# EAGLE schematic untitled (EAGLE 9.4.2)

## Sheet 1 of 6
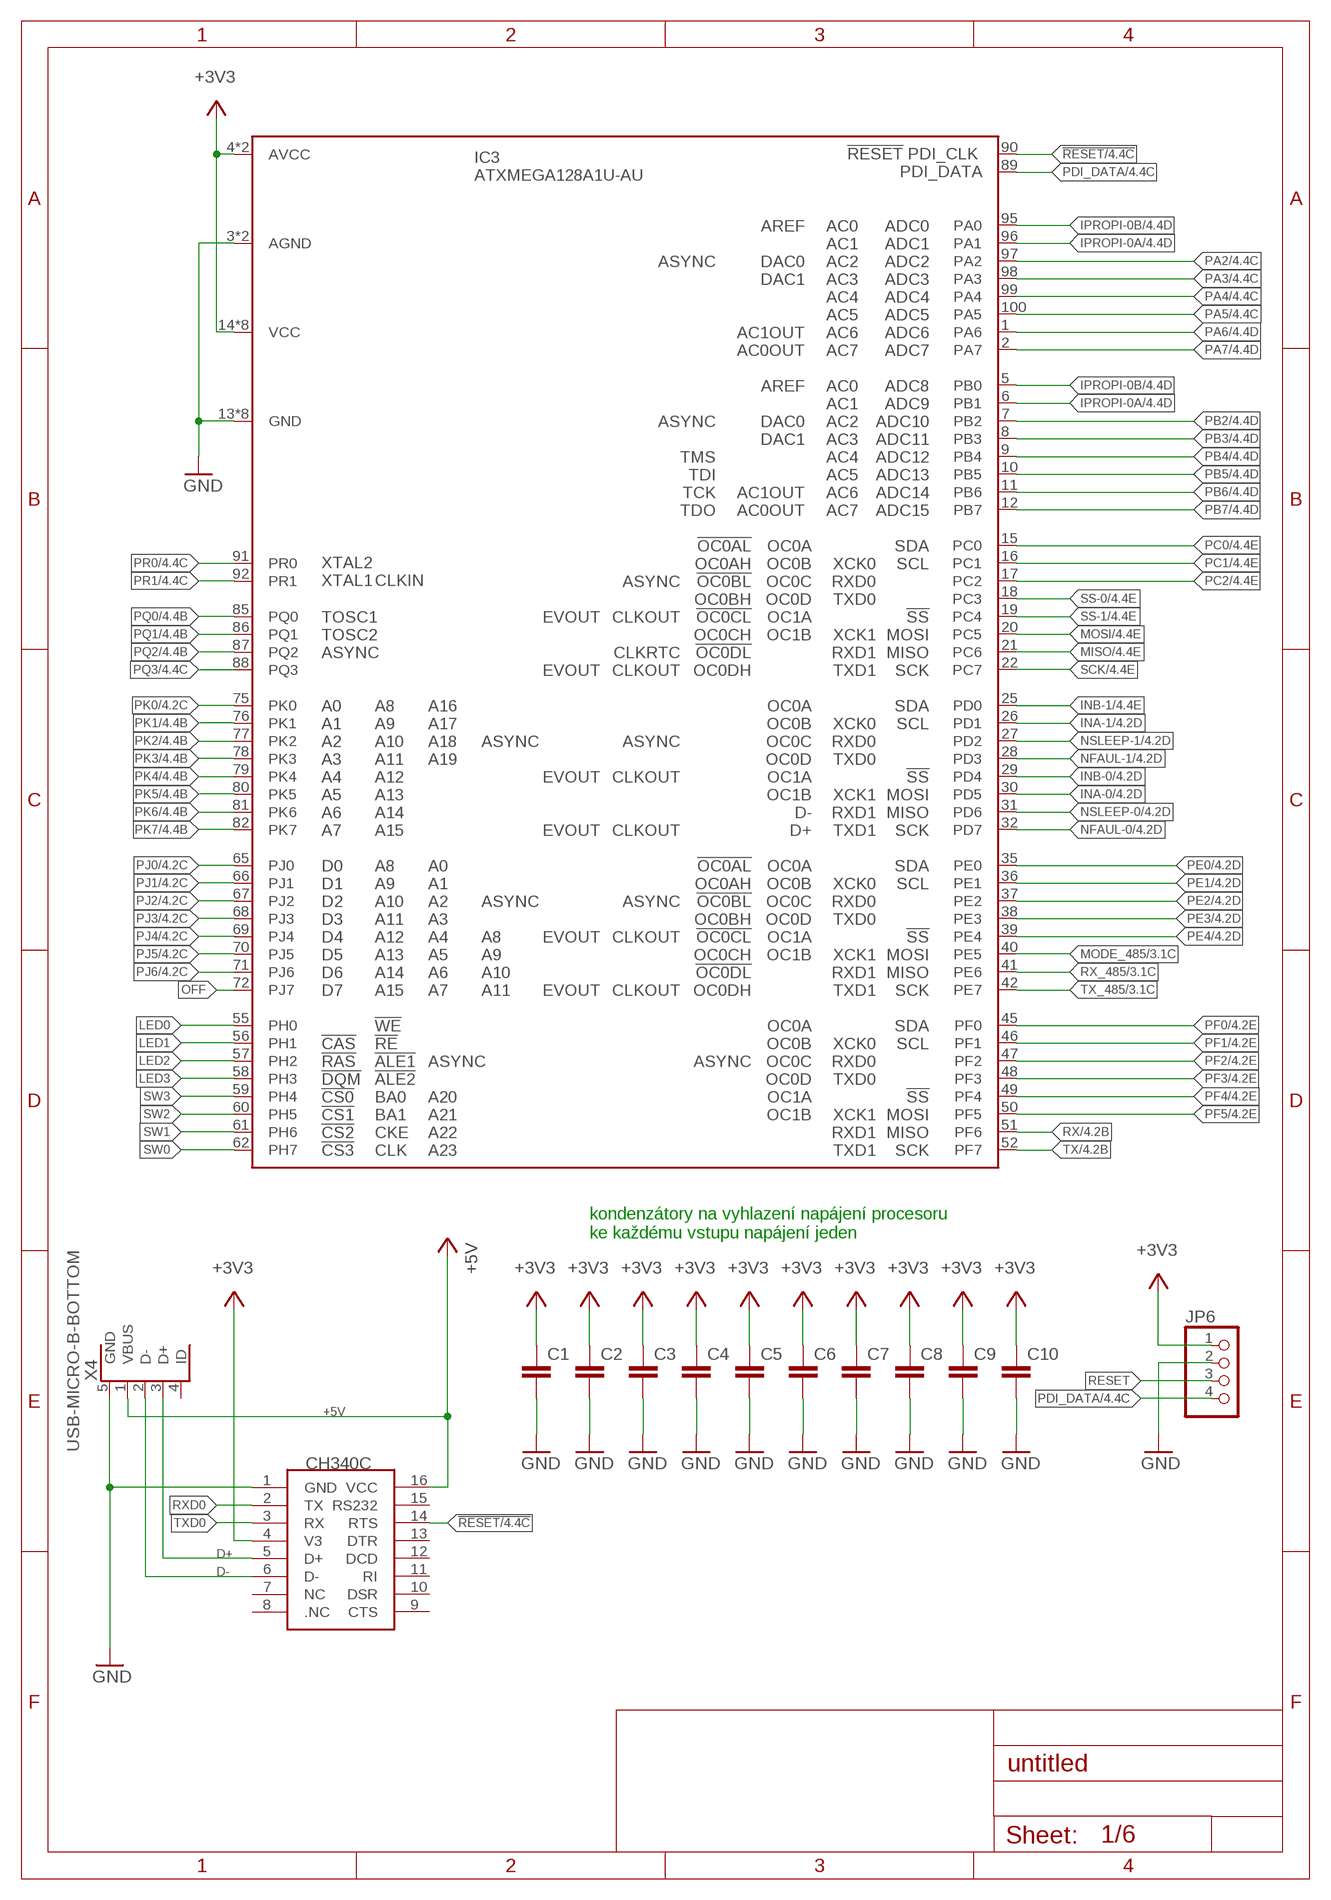
[diagram p0: schematic, sheet 1]

### Parts
C1  C-EUC0402  [C0402]
C2  C-EUC0402  [C0402]
C3  C-EUC0402  [C0402]
C4  C-EUC0402  [C0402]
C5  C-EUC0402  [C0402]
C6  C-EUC0402  [C0402]
C7  C-EUC0402  [C0402]
C8  C-EUC0402  [C0402]
C9  C-EUC0402  [C0402]
C10  C-EUC0402  [C0402]
CH2  CH340C  [SOIC16]
IC3  ATXMEGA128A1U-AU  [TQFP100]
JP6  PINHD-1X4  [1X04]
X4  USB-MICRO-B-BOTTOM  [USB-MICRO-B-BOTTOM-MOLEX]

### Nets
!RESET: CH2.14(RTS) IC3.90(RESET) ; also sheet 4
+3V3: C1.1 C2.1 C3.1 C4.1 C5.1 C6.1 C7.1 C8.1 C9.1 C10.1 CH2.4(V3) IC3.4(AVCC) IC3.14(VCC) IC3.24(VCC) IC3.34(VCC) IC3.44(VCC) IC3.54(VCC) IC3.64(VCC) IC3.74(VCC) IC3.83(VCC) IC3.94(AVCC) JP6.1 ; also sheet 2,3,4,5,6
+5V: CH2.16(VCC) X4.1(VBUS) ; also sheet 2,3
D+: CH2.5(D+) X4.3(D+)
D-: CH2.6(D-) X4.2(D-)
GND: C1.2 C2.2 C3.2 C4.2 C5.2 C6.2 C7.2 C8.2 C9.2 C10.2 CH2.1(GND) IC3.3(AGND) IC3.13(GND) IC3.23(GND) IC3.33(GND) IC3.43(GND) IC3.53(GND) IC3.63(GND) IC3.73(GND) IC3.84(GND) IC3.93(AGND) JP6.2 X4.5(GND) ; also sheet 2,3,4,5,6
INA-0: IC3.30(PD5) ; also sheet 4,5
INA-1: IC3.26(PD1) ; also sheet 4,5
INB-0: IC3.29(PD4) ; also sheet 4,5
INB-1: IC3.25(PD0) ; also sheet 4,5
IPROPI-0A: IC3.6(PB1) IC3.96(PA1) ; also sheet 4,5
IPROPI-0B: IC3.5(PB0) IC3.95(PA0) ; also sheet 4,5
LED0: IC3.55(PH0)
LED1: IC3.56(PH1)
LED2: IC3.57(PH2)
LED3: IC3.58(PH3)
MISO: IC3.21(PC6) ; also sheet 4,5
MODE_485: IC3.40(PE5) ; also sheet 3
MOSI: IC3.20(PC5) ; also sheet 4,5
NFAUL-0: IC3.32(PD7) ; also sheet 4,5
NFAUL-1: IC3.28(PD3) ; also sheet 4,5
NSLEEP-0: IC3.31(PD6) ; also sheet 4,5
NSLEEP-1: IC3.27(PD2) ; also sheet 4,5
OFF: IC3.72(PJ7) ; also sheet 2
PA2: IC3.97(PA2) ; also sheet 4
PA3: IC3.98(PA3) ; also sheet 4
PA4: IC3.99(PA4) ; also sheet 4
PA5: IC3.100(PA5) ; also sheet 4
PA6: IC3.1(PA6) ; also sheet 4
PA7: IC3.2(PA7) ; also sheet 4
PB2: IC3.7(PB2) ; also sheet 4
PB3: IC3.8(PB3) ; also sheet 4
PB4: IC3.9(PB4) ; also sheet 4
PB5: IC3.10(PB5) ; also sheet 4
PB6: IC3.11(PB6) ; also sheet 4
PB7: IC3.12(PB7) ; also sheet 4
PC0: IC3.15(PC0) ; also sheet 4
PC1: IC3.16(PC1) ; also sheet 4
PC2: IC3.17(PC2) ; also sheet 4
PDI_DATA: IC3.89(PDI_DATA) JP6.4 ; also sheet 4
PE0: IC3.35(PE0) ; also sheet 4
PE1: IC3.36(PE1) ; also sheet 4
PE2: IC3.37(PE2) ; also sheet 4
PE3: IC3.38(PE3) ; also sheet 4
PE4: IC3.39(PE4) ; also sheet 4
PF0: IC3.45(PF0) ; also sheet 4
PF1: IC3.46(PF1) ; also sheet 4
PF2: IC3.47(PF2) ; also sheet 4
PF3: IC3.48(PF3) ; also sheet 4
PF4: IC3.49(PF4) ; also sheet 4
PF5: IC3.50(PF5) ; also sheet 4
PJ0: IC3.65(PJ0) ; also sheet 4
PJ1: IC3.66(PJ1) ; also sheet 4
PJ2: IC3.67(PJ2) ; also sheet 4
PJ3: IC3.68(PJ3) ; also sheet 4
PJ4: IC3.69(PJ4) ; also sheet 4
PJ5: IC3.70(PJ5) ; also sheet 4
PJ6: IC3.71(PJ6) ; also sheet 4
PK0: IC3.75(PK0) ; also sheet 4
PK1: IC3.76(PK1) ; also sheet 4
PK2: IC3.77(PK2) ; also sheet 4
PK3: IC3.78(PK3) ; also sheet 4
PK4: IC3.79(PK4) ; also sheet 4
PK5: IC3.80(PK5) ; also sheet 4
PK6: IC3.81(PK6) ; also sheet 4
PK7: IC3.82(PK7) ; also sheet 4
PQ0: IC3.85(PQ0) ; also sheet 4
PQ1: IC3.86(PQ1) ; also sheet 4
PQ2: IC3.87(PQ2) ; also sheet 4
PQ3: IC3.88(PQ3) ; also sheet 4
PR0: IC3.91(PR0) ; also sheet 4
PR1: IC3.92(PR1) ; also sheet 4
RESET: JP6.3
RX: IC3.51(PF6) ; also sheet 4
RX_485: IC3.41(PE6) ; also sheet 3,4
RXD0: CH2.2(TX)
SCK: IC3.22(PC7) ; also sheet 4
SS-0: IC3.18(PC3) ; also sheet 4,5
SS-1: IC3.19(PC4) ; also sheet 4,5
SW0: IC3.62(PH7)
SW1: IC3.61(PH6)
SW2: IC3.60(PH5)
SW3: IC3.59(PH4)
TX: IC3.52(PF7) ; also sheet 4
TX_485: IC3.42(PE7) ; also sheet 3,4
TXD0: CH2.3(RX)
Unconnected: CH2.7(NC) CH2.8(.NC) CH2.9(CTS) CH2.10(DSR) CH2.11(RI) CH2.12(DCD) CH2.13(DTR) CH2.15(RS232) X4.4(ID)

### Notes on the sheet
- kondenzátory na vyhlazení napájení procesoru
  ke každému vstupu napájení jeden

## Sheet 2 of 6
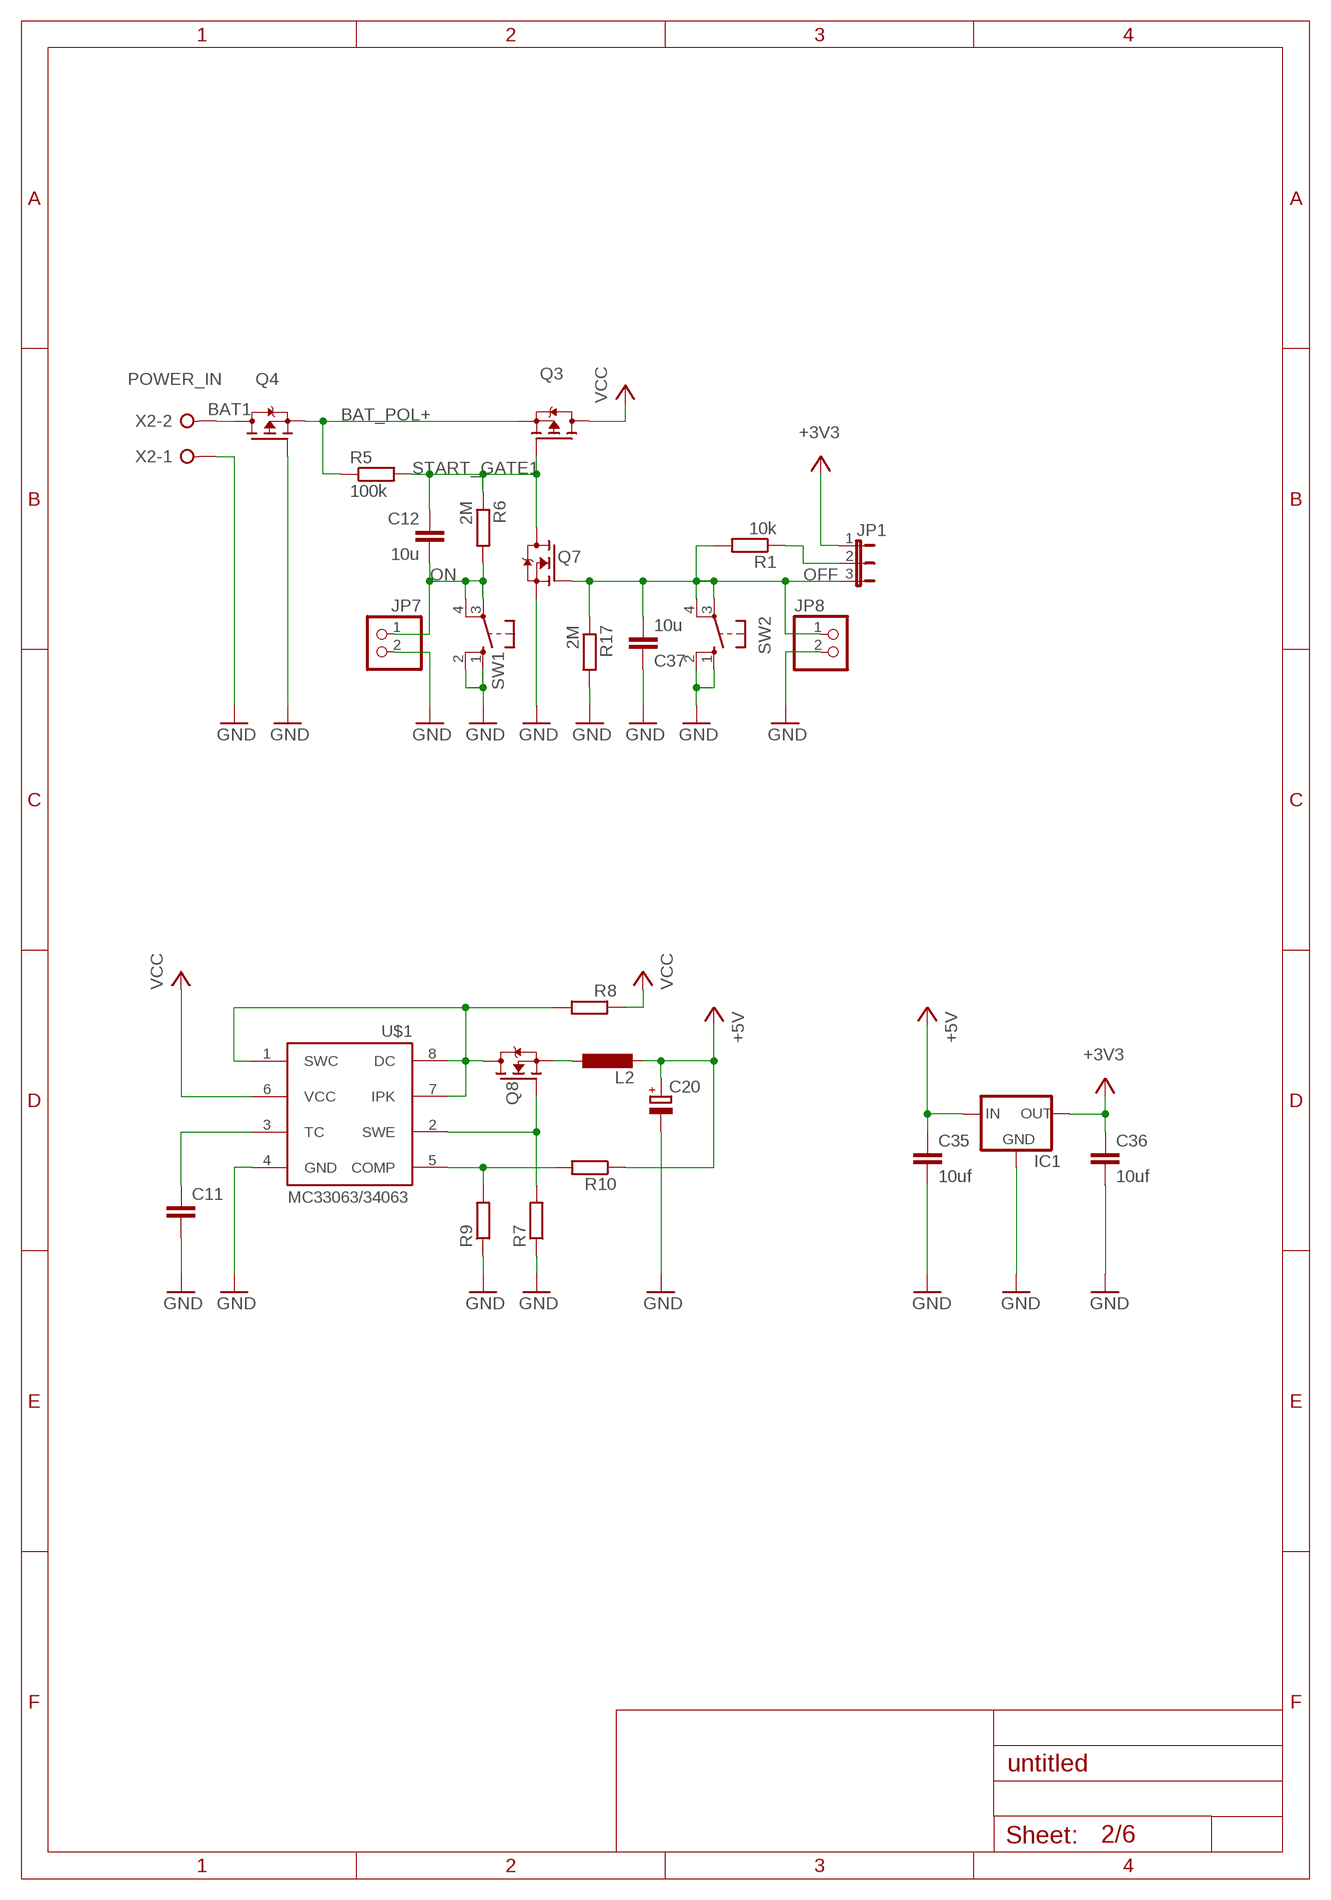
[diagram p1: schematic, sheet 2]

### Parts
C11  C-EUC0603  [C0603]
C12  10u  C-EUC1206  [C1206]
C20  CPOL-EUD  [PANASONIC_D]
C35  10uf  C-EUC0805  [C0805]
C36  10uf  C-EUC0805  [C0805]
C37  10u  C-EUC1206  [C1206]
IC1  LM1117  [SOT223]
JP1  JP2E  [JP2]
JP7  PINHD-1X2  [1X02]
JP8  PINHD-1X2  [1X02]
L2  L-EUL3216C  [L3216C]
Q3  P-MOSFET-MLP_HS  [MLP3.3X3.3_HS]
Q4  P-MOSFET-MLP_HS  [MLP3.3X3.3_HS]
Q7  N-MOSFET-SOT23-GSD  [SOT23]
Q8  N-MOSFET-SOT23-GSD  [SOT23]
R1  10k  R-EU_R0805  [R0805]
R5  100k  R-EU_R0805  [R0805]
R6  2M  R-EU_M0805  [M0805]
R7  R-EU_R0603  [R0603]
R8  R-EU_R0603  [R0603]
R9  R-EU_R0603  [R0603]
R10  R-EU_R0603  [R0603]
R17  2M  R-EU_M0805  [M0805]
SW1  10-XX  [B3F-10XX]
SW2  10-XX  [B3F-10XX]
U$1  MC33063/MC34063D  [SO08]
X2  POWER_IN  W237-02P  [W237-132]

### Nets
+3V3: C36.1 IC1.2(OUT) JP1.1 ; also sheet 1,3,4,5,6
+5V: C20.+ C35.1 IC1.3(IN) L2.2 R10.1 ; also sheet 1,3
BAT1: Q4.5(D) Q4.6(D) Q4.7(D) Q4.8(D) X2.2
BAT_POL+: Q3.1(S) Q3.2(S) Q3.3(S) Q4.1(S) Q4.2(S) Q4.3(S) R5.1
GND: C11.2 C20.- C35.2 C36.2 C37.1 IC1.1(GND) JP7.2 JP8.2 Q4.4(G) Q7.2(S) R7.1 R9.1 R17.2 SW1.1(S) SW1.2(S1) SW2.1(S) SW2.2(S1) U$1.4(GND) X2.1 ; also sheet 1,3,4,5,6
N$2: JP1.2 R1.1
N$3: Q8.3(D) R8.2 U$1.1(SWC) U$1.7(IPK) U$1.8(DC)
N$4: R9.2 R10.2 U$1.5(COMP)
N$5: C11.1 U$1.3(TC)
N$6: L2.1 Q8.2(S)
N$7: Q8.1(G) R7.2 U$1.2(SWE)
OFF: C37.2 JP1.3 JP8.1 Q7.1(G) R1.2 R17.1 SW2.3(P) SW2.4(P1) ; also sheet 1
ON: C12.2 JP7.1 R6.2 SW1.3(P) SW1.4(P1)
START_GATE1: C12.1 Q3.4(G) Q7.3(D) R5.2 R6.1
VCC: Q3.5(D) Q3.6(D) Q3.7(D) Q3.8(D) R8.1 U$1.6(VCC) ; also sheet 5,6

## Sheet 3 of 6
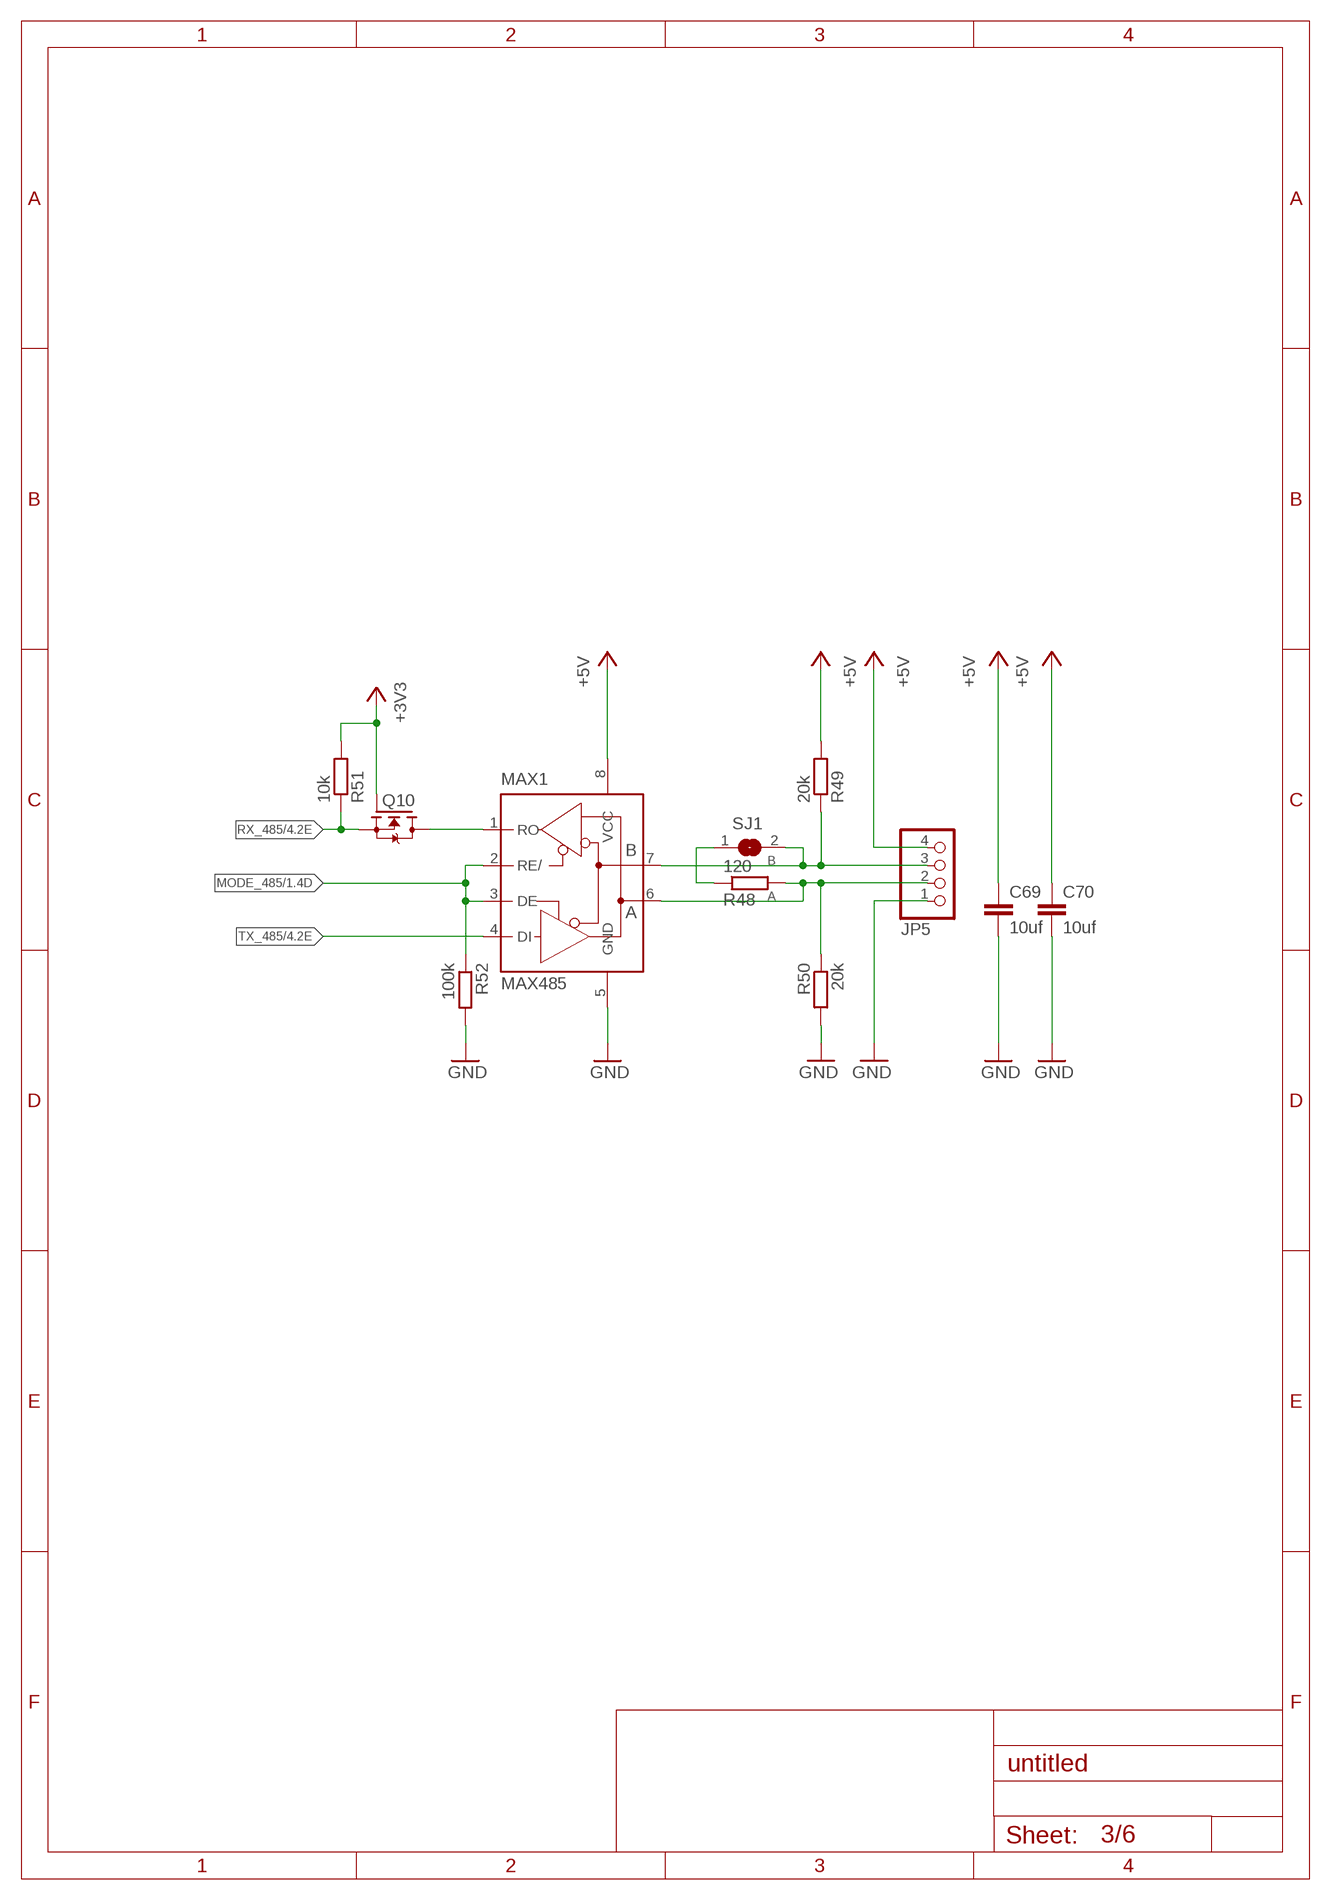
[diagram p2: schematic, sheet 3]

### Parts
C69  10uf  C-EUC0402K  [C0402K]
C70  10uf  C-EUC0402K  [C0402K]
JP5  PINHD-1X4  [1X04]
MAX1  MAX485  [SO08]
Q10  N-MOSFET-SOT23-GSD  [SOT23]
R48  120  R-EU_R0402  [R0402]
R49  20k  R-EU_R0402  [R0402]
R50  20k  R-EU_R0402  [R0402]
R51  10k  R-EU_R0402  [R0402]
R52  100k  R-EU_R0402  [R0402]
SJ1  SJ  [SJ]

### Nets
+3V3: Q10.1(G) R51.2 ; also sheet 1,2,4,5,6
+5V: C69.1 C70.1 JP5.4 MAX1.8(VCC) R49.2 ; also sheet 1,2
A: JP5.2 MAX1.6(A) R48.2 R50.1
B: JP5.3 MAX1.7(B) R49.1 SJ1.2
GND: C69.2 C70.2 JP5.1 MAX1.5(GND) R50.2 R52.2 ; also sheet 1,2,4,5,6
MODE_485: MAX1.2(RE/) MAX1.3(DE) R52.1 ; also sheet 1
N$1: R48.1 SJ1.1
RX-485-5V: MAX1.1(RO) Q10.3(D)
RX_485: Q10.2(S) R51.1 ; also sheet 1,4
TX_485: MAX1.4(DI) ; also sheet 1,4

## Sheet 4 of 6
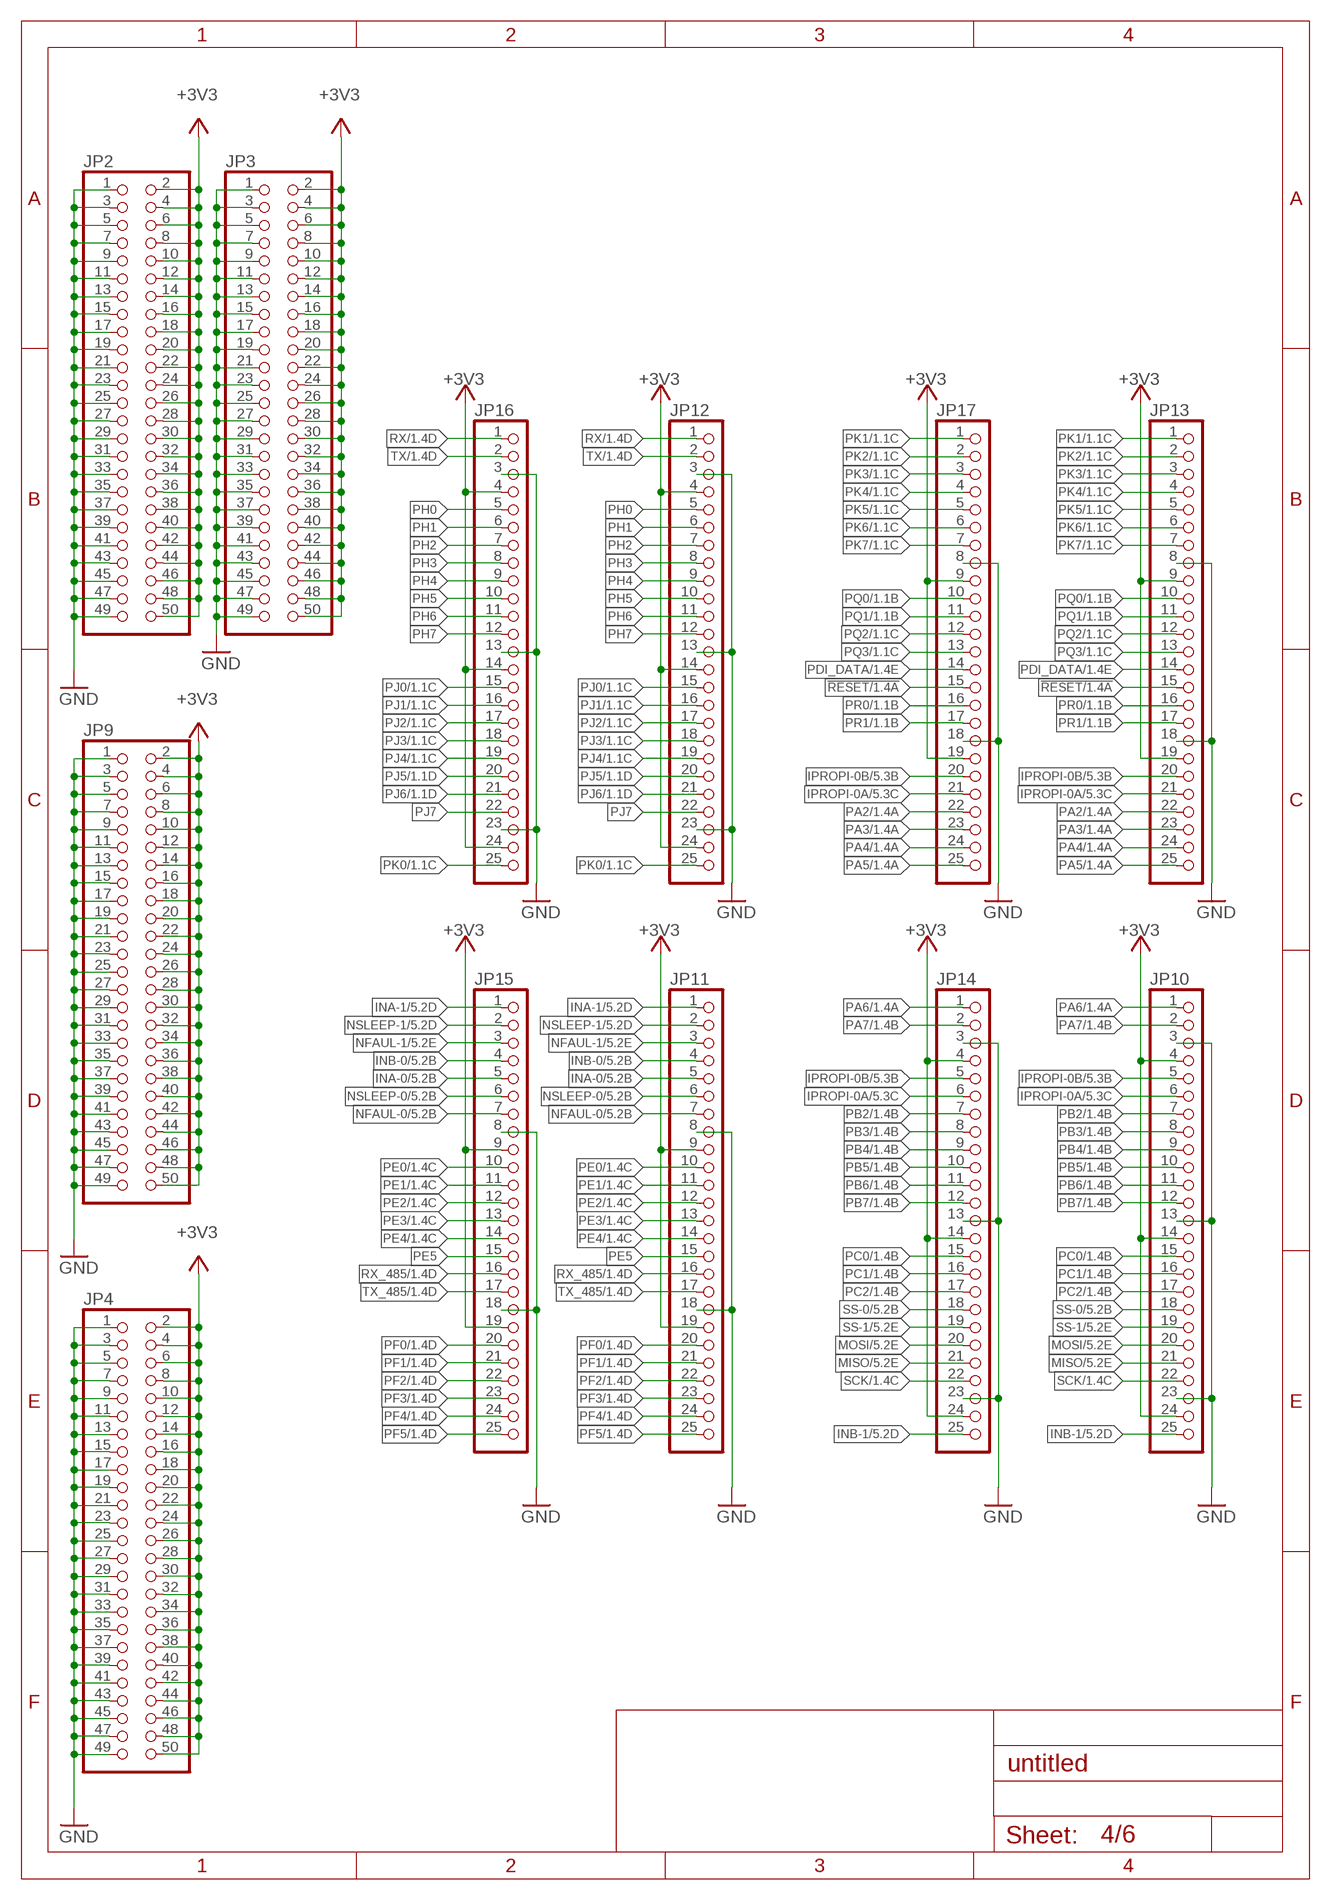
[diagram p3: schematic, sheet 4]

### Parts
JP2  PINHD-2X25  [2X25]
JP3  PINHD-2X25  [2X25]
JP4  PINHD-2X25  [2X25]
JP9  PINHD-2X25  [2X25]
JP10  PINHD-1X25  [1X25]
JP11  PINHD-1X25  [1X25]
JP12  PINHD-1X25  [1X25]
JP13  PINHD-1X25  [1X25]
JP14  PINHD-1X25  [1X25]
JP15  PINHD-1X25  [1X25]
JP16  PINHD-1X25  [1X25]
JP17  PINHD-1X25  [1X25]

### Nets
!RESET: JP13.15 JP17.15 ; also sheet 1
+3V3: JP2.2 JP2.4 JP2.6 JP2.8 JP2.10 JP2.12 JP2.14 JP2.16 JP2.18 JP2.20 JP2.22 JP2.24 JP2.26 JP2.28 JP2.30 JP2.32 JP2.34 JP2.36 JP2.38 JP2.40 JP2.42 JP2.44 JP2.46 JP2.48 JP2.50 JP3.2 JP3.4 JP3.6 JP3.8 JP3.10 JP3.12 JP3.14 JP3.16 JP3.18 JP3.20 JP3.22 JP3.24 JP3.26 JP3.28 JP3.30 JP3.32 JP3.34 JP3.36 JP3.38 JP3.40 JP3.42 JP3.44 JP3.46 JP3.48 JP3.50 JP4.2 JP4.4 JP4.6 JP4.8 JP4.10 JP4.12 JP4.14 JP4.16 JP4.18 JP4.20 JP4.22 JP4.24 JP4.26 JP4.28 JP4.30 JP4.32 JP4.34 JP4.36 JP4.38 JP4.40 JP4.42 JP4.44 JP4.46 JP4.48 JP4.50 JP9.2 JP9.4 JP9.6 JP9.8 JP9.10 JP9.12 JP9.14 JP9.16 JP9.18 JP9.20 JP9.22 JP9.24 JP9.26 JP9.28 JP9.30 JP9.32 JP9.34 JP9.36 JP9.38 JP9.40 JP9.42 JP9.44 JP9.46 JP9.48 JP9.50 JP10.4 JP10.14 JP10.24 JP11.9 JP11.19 JP12.4 JP12.14 JP12.24 JP13.9 JP13.19 JP14.4 JP14.14 JP14.24 JP15.9 JP15.19 JP16.4 JP16.14 JP16.24 JP17.9 JP17.19 ; also sheet 1,2,3,5,6
GND: JP2.1 JP2.3 JP2.5 JP2.7 JP2.9 JP2.11 JP2.13 JP2.15 JP2.17 JP2.19 JP2.21 JP2.23 JP2.25 JP2.27 JP2.29 JP2.31 JP2.33 JP2.35 JP2.37 JP2.39 JP2.41 JP2.43 JP2.45 JP2.47 JP2.49 JP3.1 JP3.3 JP3.5 JP3.7 JP3.9 JP3.11 JP3.13 JP3.15 JP3.17 JP3.19 JP3.21 JP3.23 JP3.25 JP3.27 JP3.29 JP3.31 JP3.33 JP3.35 JP3.37 JP3.39 JP3.41 JP3.43 JP3.45 JP3.47 JP3.49 JP4.1 JP4.3 JP4.5 JP4.7 JP4.9 JP4.11 JP4.13 JP4.15 JP4.17 JP4.19 JP4.21 JP4.23 JP4.25 JP4.27 JP4.29 JP4.31 JP4.33 JP4.35 JP4.37 JP4.39 JP4.41 JP4.43 JP4.45 JP4.47 JP4.49 JP9.1 JP9.3 JP9.5 JP9.7 JP9.9 JP9.11 JP9.13 JP9.15 JP9.17 JP9.19 JP9.21 JP9.23 JP9.25 JP9.27 JP9.29 JP9.31 JP9.33 JP9.35 JP9.37 JP9.39 JP9.41 JP9.43 JP9.45 JP9.47 JP9.49 JP10.3 JP10.13 JP10.23 JP11.8 JP11.18 JP12.3 JP12.13 JP12.23 JP13.8 JP13.18 JP14.3 JP14.13 JP14.23 JP15.8 JP15.18 JP16.3 JP16.13 JP16.23 JP17.8 JP17.18 ; also sheet 1,2,3,5,6
INA-0: JP11.5 JP15.5 ; also sheet 1,5
INA-1: JP11.1 JP15.1 ; also sheet 1,5
INB-0: JP11.4 JP15.4 ; also sheet 1,5
INB-1: JP10.25 JP14.25 ; also sheet 1,5
IPROPI-0A: JP10.6 JP13.21 JP14.6 JP17.21 ; also sheet 1,5
IPROPI-0B: JP10.5 JP13.20 JP14.5 JP17.20 ; also sheet 1,5
MISO: JP10.21 JP14.21 ; also sheet 1,5
MOSI: JP10.20 JP14.20 ; also sheet 1,5
NFAUL-0: JP11.7 JP15.7 ; also sheet 1,5
NFAUL-1: JP11.3 JP15.3 ; also sheet 1,5
NSLEEP-0: JP11.6 JP15.6 ; also sheet 1,5
NSLEEP-1: JP11.2 JP15.2 ; also sheet 1,5
PA2: JP13.22 JP17.22 ; also sheet 1
PA3: JP13.23 JP17.23 ; also sheet 1
PA4: JP13.24 JP17.24 ; also sheet 1
PA5: JP13.25 JP17.25 ; also sheet 1
PA6: JP10.1 JP14.1 ; also sheet 1
PA7: JP10.2 JP14.2 ; also sheet 1
PB2: JP10.7 JP14.7 ; also sheet 1
PB3: JP10.8 JP14.8 ; also sheet 1
PB4: JP10.9 JP14.9 ; also sheet 1
PB5: JP10.10 JP14.10 ; also sheet 1
PB6: JP10.11 JP14.11 ; also sheet 1
PB7: JP10.12 JP14.12 ; also sheet 1
PC0: JP10.15 JP14.15 ; also sheet 1
PC1: JP10.16 JP14.16 ; also sheet 1
PC2: JP10.17 JP14.17 ; also sheet 1
PDI_DATA: JP13.14 JP17.14 ; also sheet 1
PE0: JP11.10 JP15.10 ; also sheet 1
PE1: JP11.11 JP15.11 ; also sheet 1
PE2: JP11.12 JP15.12 ; also sheet 1
PE3: JP11.13 JP15.13 ; also sheet 1
PE4: JP11.14 JP15.14 ; also sheet 1
PE5: JP11.15 JP15.15
PF0: JP11.20 JP15.20 ; also sheet 1
PF1: JP11.21 JP15.21 ; also sheet 1
PF2: JP11.22 JP15.22 ; also sheet 1
PF3: JP11.23 JP15.23 ; also sheet 1
PF4: JP11.24 JP15.24 ; also sheet 1
PF5: JP11.25 JP15.25 ; also sheet 1
PH0: JP12.5 JP16.5
PH1: JP12.6 JP16.6
PH2: JP12.7 JP16.7
PH3: JP12.8 JP16.8
PH4: JP12.9 JP16.9
PH5: JP12.10 JP16.10
PH6: JP12.11 JP16.11
PH7: JP12.12 JP16.12
PJ0: JP12.15 JP16.15 ; also sheet 1
PJ1: JP12.16 JP16.16 ; also sheet 1
PJ2: JP12.17 JP16.17 ; also sheet 1
PJ3: JP12.18 JP16.18 ; also sheet 1
PJ4: JP12.19 JP16.19 ; also sheet 1
PJ5: JP12.20 JP16.20 ; also sheet 1
PJ6: JP12.21 JP16.21 ; also sheet 1
PJ7: JP12.22 JP16.22
PK0: JP12.25 JP16.25 ; also sheet 1
PK1: JP13.1 JP17.1 ; also sheet 1
PK2: JP13.2 JP17.2 ; also sheet 1
PK3: JP13.3 JP17.3 ; also sheet 1
PK4: JP13.4 JP17.4 ; also sheet 1
PK5: JP13.5 JP17.5 ; also sheet 1
PK6: JP13.6 JP17.6 ; also sheet 1
PK7: JP13.7 JP17.7 ; also sheet 1
PQ0: JP13.10 JP17.10 ; also sheet 1
PQ1: JP13.11 JP17.11 ; also sheet 1
PQ2: JP13.12 JP17.12 ; also sheet 1
PQ3: JP13.13 JP17.13 ; also sheet 1
PR0: JP13.16 JP17.16 ; also sheet 1
PR1: JP13.17 JP17.17 ; also sheet 1
RX: JP12.1 JP16.1 ; also sheet 1
RX_485: JP11.16 JP15.16 ; also sheet 1,3
SCK: JP10.22 JP14.22 ; also sheet 1
SS-0: JP10.18 JP14.18 ; also sheet 1,5
SS-1: JP10.19 JP14.19 ; also sheet 1,5
TX: JP12.2 JP16.2 ; also sheet 1
TX_485: JP11.17 JP15.17 ; also sheet 1,3

## Sheet 5 of 6
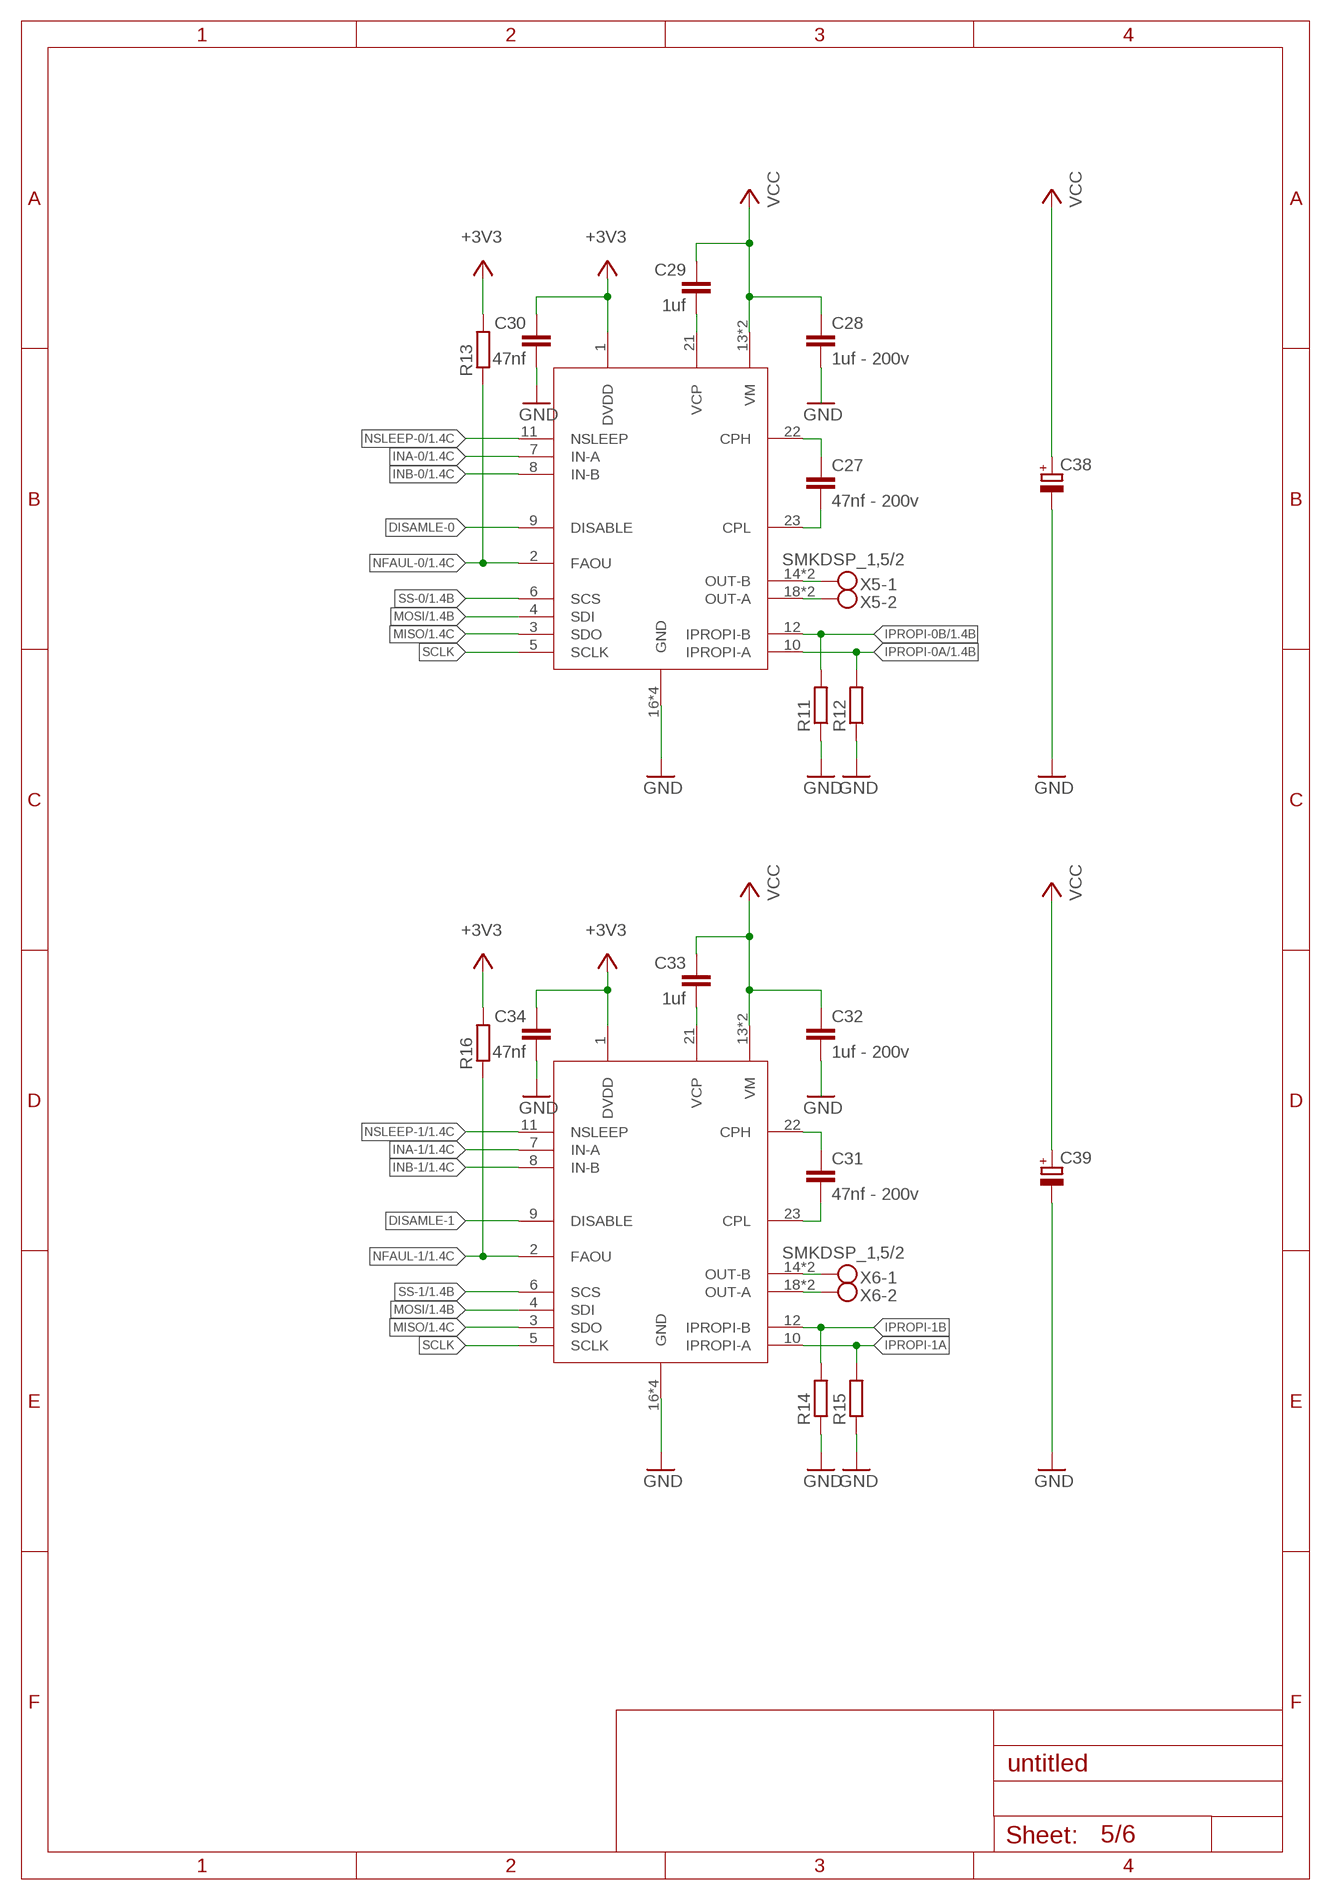
[diagram p4: schematic, sheet 5]

### Parts
C27  47nf - 200v  C-EUC0603  [C0603]
C28  1uf - 200v  C-EUC1206  [C1206]
C29  1uf  C-EUC1206  [C1206]
C30  47nf  C-EUC1206  [C1206]
C31  47nf - 200v  C-EUC0603  [C0603]
C32  1uf - 200v  C-EUC1206  [C1206]
C33  1uf  C-EUC1206  [C1206]
C34  47nf  C-EUC1206  [C1206]
C38  CPOL-EUE5-10.5  [E5-10,5]
C39  CPOL-EUE5-10.5  [E5-10,5]
R11  R-EU_R0603  [R0603]
R12  R-EU_R0603  [R0603]
R13  R-EU_R0603  [R0603]
R14  R-EU_R0603  [R0603]
R15  R-EU_R0603  [R0603]
R16  R-EU_R0603  [R0603]
U$2  DER8873  [24HTSSOP]
U$6  DER8873  [24HTSSOP]
X5  SMKDSP_1,5/2  [SMKDSP_1,5/2]
X6  SMKDSP_1,5/2  [SMKDSP_1,5/2]

### Nets
0-OUTA2: U$2.14(OUT-B) U$2.15(OUT-B) X5.1
0-OUTA3: U$6.14(OUT-B) U$6.15(OUT-B) X6.1
0-OUTB2: U$2.18(OUT-A) U$2.19(OUT-A) X5.2
0-OUTB3: U$6.18(OUT-A) U$6.19(OUT-A) X6.2
+3V3: C30.1 C34.1 R13.2 R16.2 U$2.1(DVDD) U$6.1(DVDD) ; also sheet 1,2,3,4,6
DISAMLE-0: U$2.9(DISABLE)
DISAMLE-1: U$6.9(DISABLE)
GND: C28.2 C30.2 C32.2 C34.2 C38.- C39.- R11.1 R12.1 R14.1 R15.1 U$2.16(GND) U$2.17(GND) U$2.24(GND) U$2.25(GND) U$6.16(GND) U$6.17(GND) U$6.24(GND) U$6.25(GND) ; also sheet 1,2,3,4,6
INA-0: U$2.7(IN-A) ; also sheet 1,4
INA-1: U$6.7(IN-A) ; also sheet 1,4
INB-0: U$2.8(IN-B) ; also sheet 1,4
INB-1: U$6.8(IN-B) ; also sheet 1,4
IPROPI-0A: R12.2 U$2.10(IPROPI-A) ; also sheet 1,4
IPROPI-0B: R11.2 U$2.12(IPROPI-B) ; also sheet 1,4
IPROPI-1A: R15.2 U$6.10(IPROPI-A)
IPROPI-1B: R14.2 U$6.12(IPROPI-B)
MISO: U$2.3(SDO) U$6.3(SDO) ; also sheet 1,4
MOSI: U$2.4(SDI) U$6.4(SDI) ; also sheet 1,4
N$10: C27.1 U$2.22(CPH)
N$11: C27.2 U$2.23(CPL)
N$12: C29.2 U$2.21(VCP)
N$13: C31.1 U$6.22(CPH)
N$14: C31.2 U$6.23(CPL)
N$15: C33.2 U$6.21(VCP)
NFAUL-0: R13.1 U$2.2(FAOU) ; also sheet 1,4
NFAUL-1: R16.1 U$6.2(FAOU) ; also sheet 1,4
NSLEEP-0: U$2.11(NSLEEP) ; also sheet 1,4
NSLEEP-1: U$6.11(NSLEEP) ; also sheet 1,4
SCLK: U$2.5(SCLK) U$6.5(SCLK)
SS-0: U$2.6(SCS) ; also sheet 1,4
SS-1: U$6.6(SCS) ; also sheet 1,4
VCC: C28.1 C29.1 C32.1 C33.1 C38.+ C39.+ U$2.13(VM) U$2.20(VM) U$6.13(VM) U$6.20(VM) ; also sheet 2,6

## Sheet 6 of 6
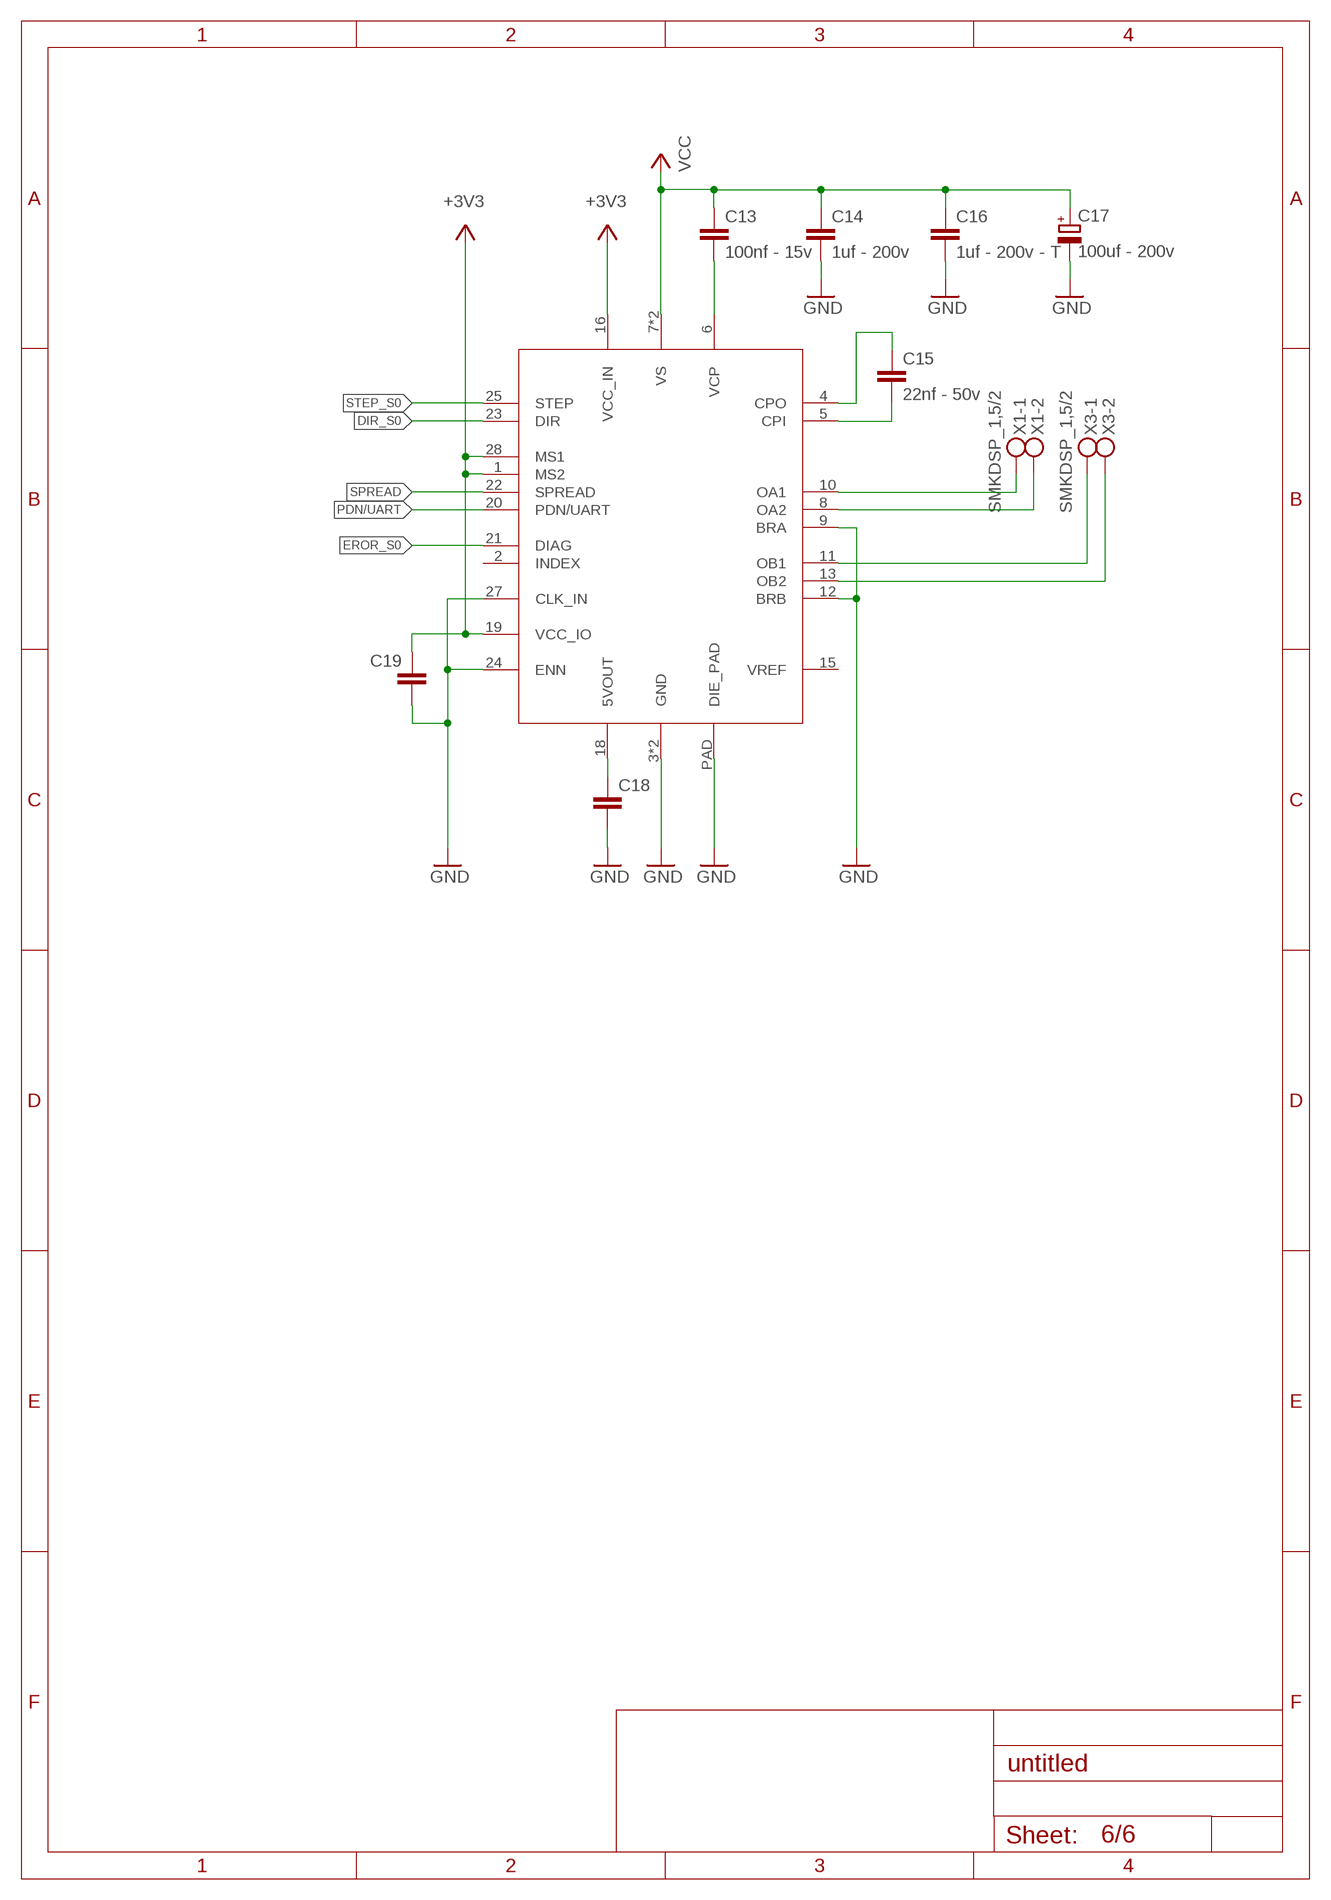
[diagram p5: schematic, sheet 6]

### Parts
C13  100nf - 15v  C-EUC1206  [C1206]
C14  1uf - 200v  C-EUC1206  [C1206]
C15  22nf - 50v  C-EUC1206  [C1206]
C16  1uf - 200v - T  C-EUC1206  [C1206]
C17  100uf - 200v  CPOL-EUE5-10.5  [E5-10,5]
C18  C-EUC0603  [C0603]
C19  C-EUC0402  [C0402]
S0  TMC2224  [QFN28]
X1  SMKDSP_1,5/2  [SMKDSP_1,5/2]
X3  SMKDSP_1,5/2  [SMKDSP_1,5/2]

### Nets
+3V3: C19.1 S0.1(MS2) S0.16(VCC_IN) S0.19(VCC_IO) S0.28(MS1) ; also sheet 1,2,3,4,5
DIR_S0: S0.23(DIR)
EROR_S0: S0.21(DIAG)
GND: C14.2 C16.2 C17.- C18.2 C19.2 S0.3(GND) S0.9(BRA) S0.12(BRB) S0.17(GND) S0.24(ENN) S0.27(CLK_IN) S0.PAD(DIE_PAD) ; also sheet 1,2,3,4,5
N$8: C13.2 S0.6(VCP)
N$9: C18.1 S0.18(5VOUT)
N$16: C15.1 S0.4(CPO)
N$17: C15.2 S0.5(CPI)
N$19: S0.10(OA1) X1.1
N$20: S0.8(OA2) X1.2
N$21: S0.11(OB1) X3.1
N$22: S0.13(OB2) X3.2
PDN/UART: S0.20(PDN/UART)
SPREAD: S0.22(SPREAD)
STEP_S0: S0.25(STEP)
VCC: C13.1 C14.1 C16.1 C17.+ S0.7(VS) S0.14(VS) ; also sheet 2,5
Unconnected: S0.2(INDEX) S0.15(VREF)

## Library data of the parts
C1-C11 C13-C16 C18 C19 C27-C36 C69 C70 = rcl:C-EU: CAPACITOR, European symbol; SPICEPREFIX: C
C12 C37 = rcl_upravena:C-EU: CAPACITOR, European symbol
C17 C20 C38 C39 = rcl:CPOL-EU: POLARIZED CAPACITOR, European symbol; SPICEPREFIX: C
CH2 = ch340g:CH340C
IC1 = v-reg-2:LM1117
IC3 = xmega:ATXMEGA*A1U
JP1 = jumper:JP2E: JUMPER
JP2-JP4 JP9 = pinhead:PINHD-2X25: PIN HEADER
JP5 JP6 = pinhead:PINHD-1X4: PIN HEADER
JP7 JP8 = pinhead:PINHD-1X2: PIN HEADER
JP10-JP17 = pinhead:PINHD-1X25: PIN HEADER
L2 = rcl:L-EU: INDUCTOR, European symbol; SPICEPREFIX: L
MAX1 = maxim:MAX485
Q3 Q4 = transistors:P-MOSFET
Q7 Q8 Q10 = transistors:N-MOSFET
R1 R5 R6 R17 = rcl_upravena:R-EU_: RESISTOR, European symbol
R7-R16 R48-R52 = rcl:R-EU_: RESISTOR, European symbol; SPICEPREFIX: R
S0 = TRINAMIC:TMC2224
SJ1 = jumper:SJ: SMD solder JUMPER
SW1 SW2 = switch-omron:10-XX: OMRON SWITCH; MPN: B3F-1000; OC_FARNELL: 176432; OC_NEWARK: 36M3542
U$1 = adafruit:MC33063/MC34063: MC33063 and MC34063 Basic DC/DC converter with internal power-NPN transistor, 100KHz, 1.5A peak switch current. 3-40 input/output.
U$2 U$6 = texas_instrument:DER8873
X1 X3 X5 X6 = con-phoenix-smkdsp:SMKDSP_1,5/2: Printklemme, Nennstrom: 17,5 A, Bemessungsspannung: 250 V, Raster: 5,0 mm Source: http://eshop.phoenixcontact.de .. 1733415.pdf; MF: FARNELL; MPN: 1733570; OC_FARNELL: 3041244; OC_NEWARK: 69C8588
X2 = con-wago-508:W237-02P: WAGO SREW CLAMP; OC_FARNELL: unknown; OC_NEWARK: unknown
X4 = usb:USB

## Net classes
0 default: width 0.2 mm, drill 0.35 mm, clearance 0.2 mm